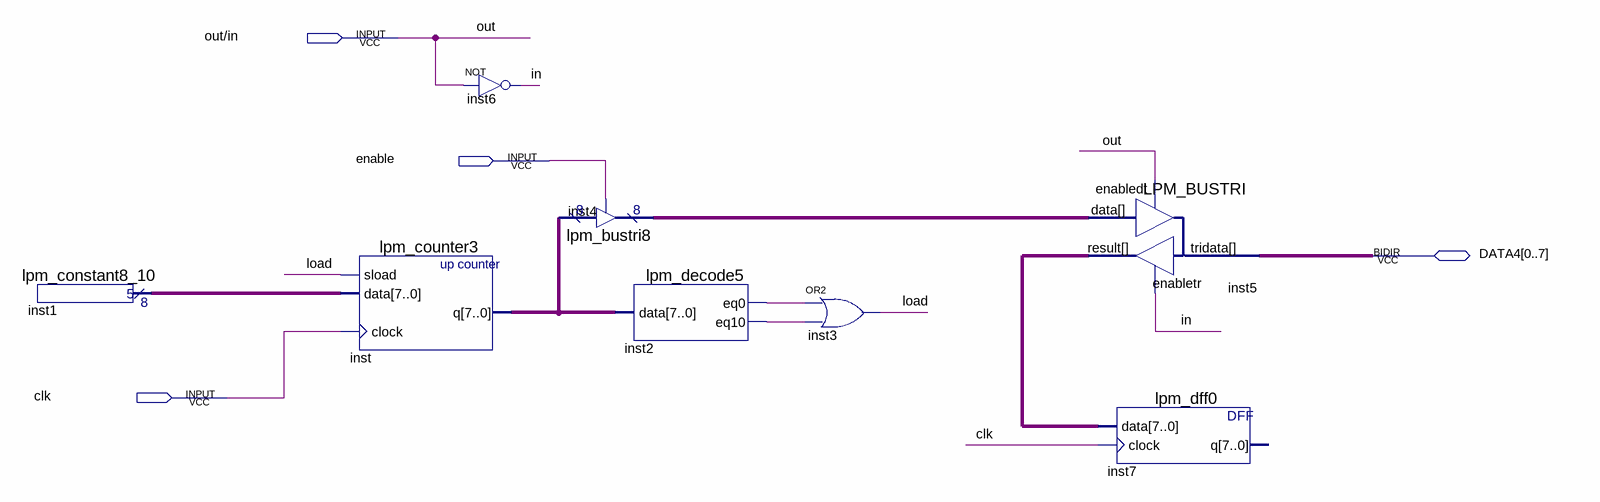
[diagram p0: schematic sheet]
// Quartus schematic PD1.bdf as structural Verilog: 8 symbols, 4 pins
module PD1 (
  input  \out/in ,
  input  enable,
  input  clk,
  inout  [0:7] DATA4
);

  wire in, inst2_eq0, inst2_eq10, load;
  wire [7:0] inst1_result, inst4_tridata, inst5_result, inst_q;

  lpm_constant8_10 inst1 (.result(inst1_result));
  lpm_counter3 inst (.sload(load), .data(inst1_result), .clock(clk), .q(inst_q));
  not inst6 (in, \out/in );
  lpm_bustri8 inst4 (.enabledt(enable), .data(inst_q), .tridata(inst4_tridata));
  lpm_decode5 inst2 (.data(inst_q), .eq0(inst2_eq0), .eq10(inst2_eq10));
  or inst3 (load, inst2_eq0, inst2_eq10);
  LPM_BUSTRI inst5 (.data(inst4_tridata), .enabledt(\out/in ), .enabletr(in), .result(inst5_result), .tridata(DATA4));
  lpm_dff0 inst7 (.data(inst5_result), .clock(clk));  // open: q

  // Other names for the same wires on the sheet: out = \out/in 
endmodule
